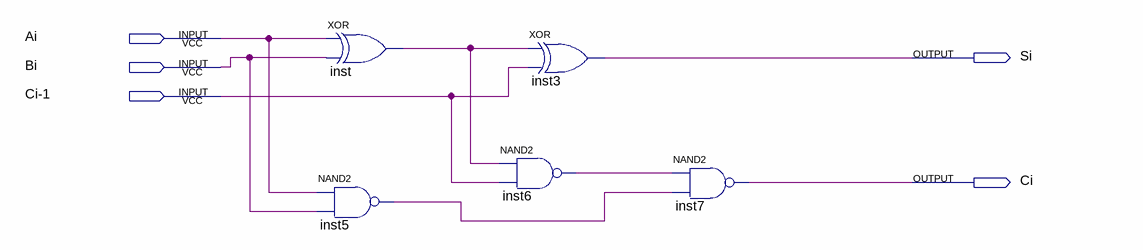
[diagram p0: schematic sheet]
// Quartus schematic qjq.bdf as structural Verilog: 5 symbols, 5 pins
module qjq (
  input  Ai,
  input  Bi,
  input  \Ci-1 ,
  output Si,
  output Ci
);

  wire inst5_out, inst6_out, inst_out;

  nand inst5 (inst5_out, Ai, Bi);
  xor inst (inst_out, Ai, Bi);
  xor inst3 (Si, inst_out, \Ci-1 );
  nand inst6 (inst6_out, inst_out, \Ci-1 );
  nand inst7 (Ci, inst6_out, inst5_out);
endmodule
